# Altium schematic sheet DaughterBoard_Slots.SchDoc
size OrCAD B; SheetNumber: 3; SheetTotal: 6
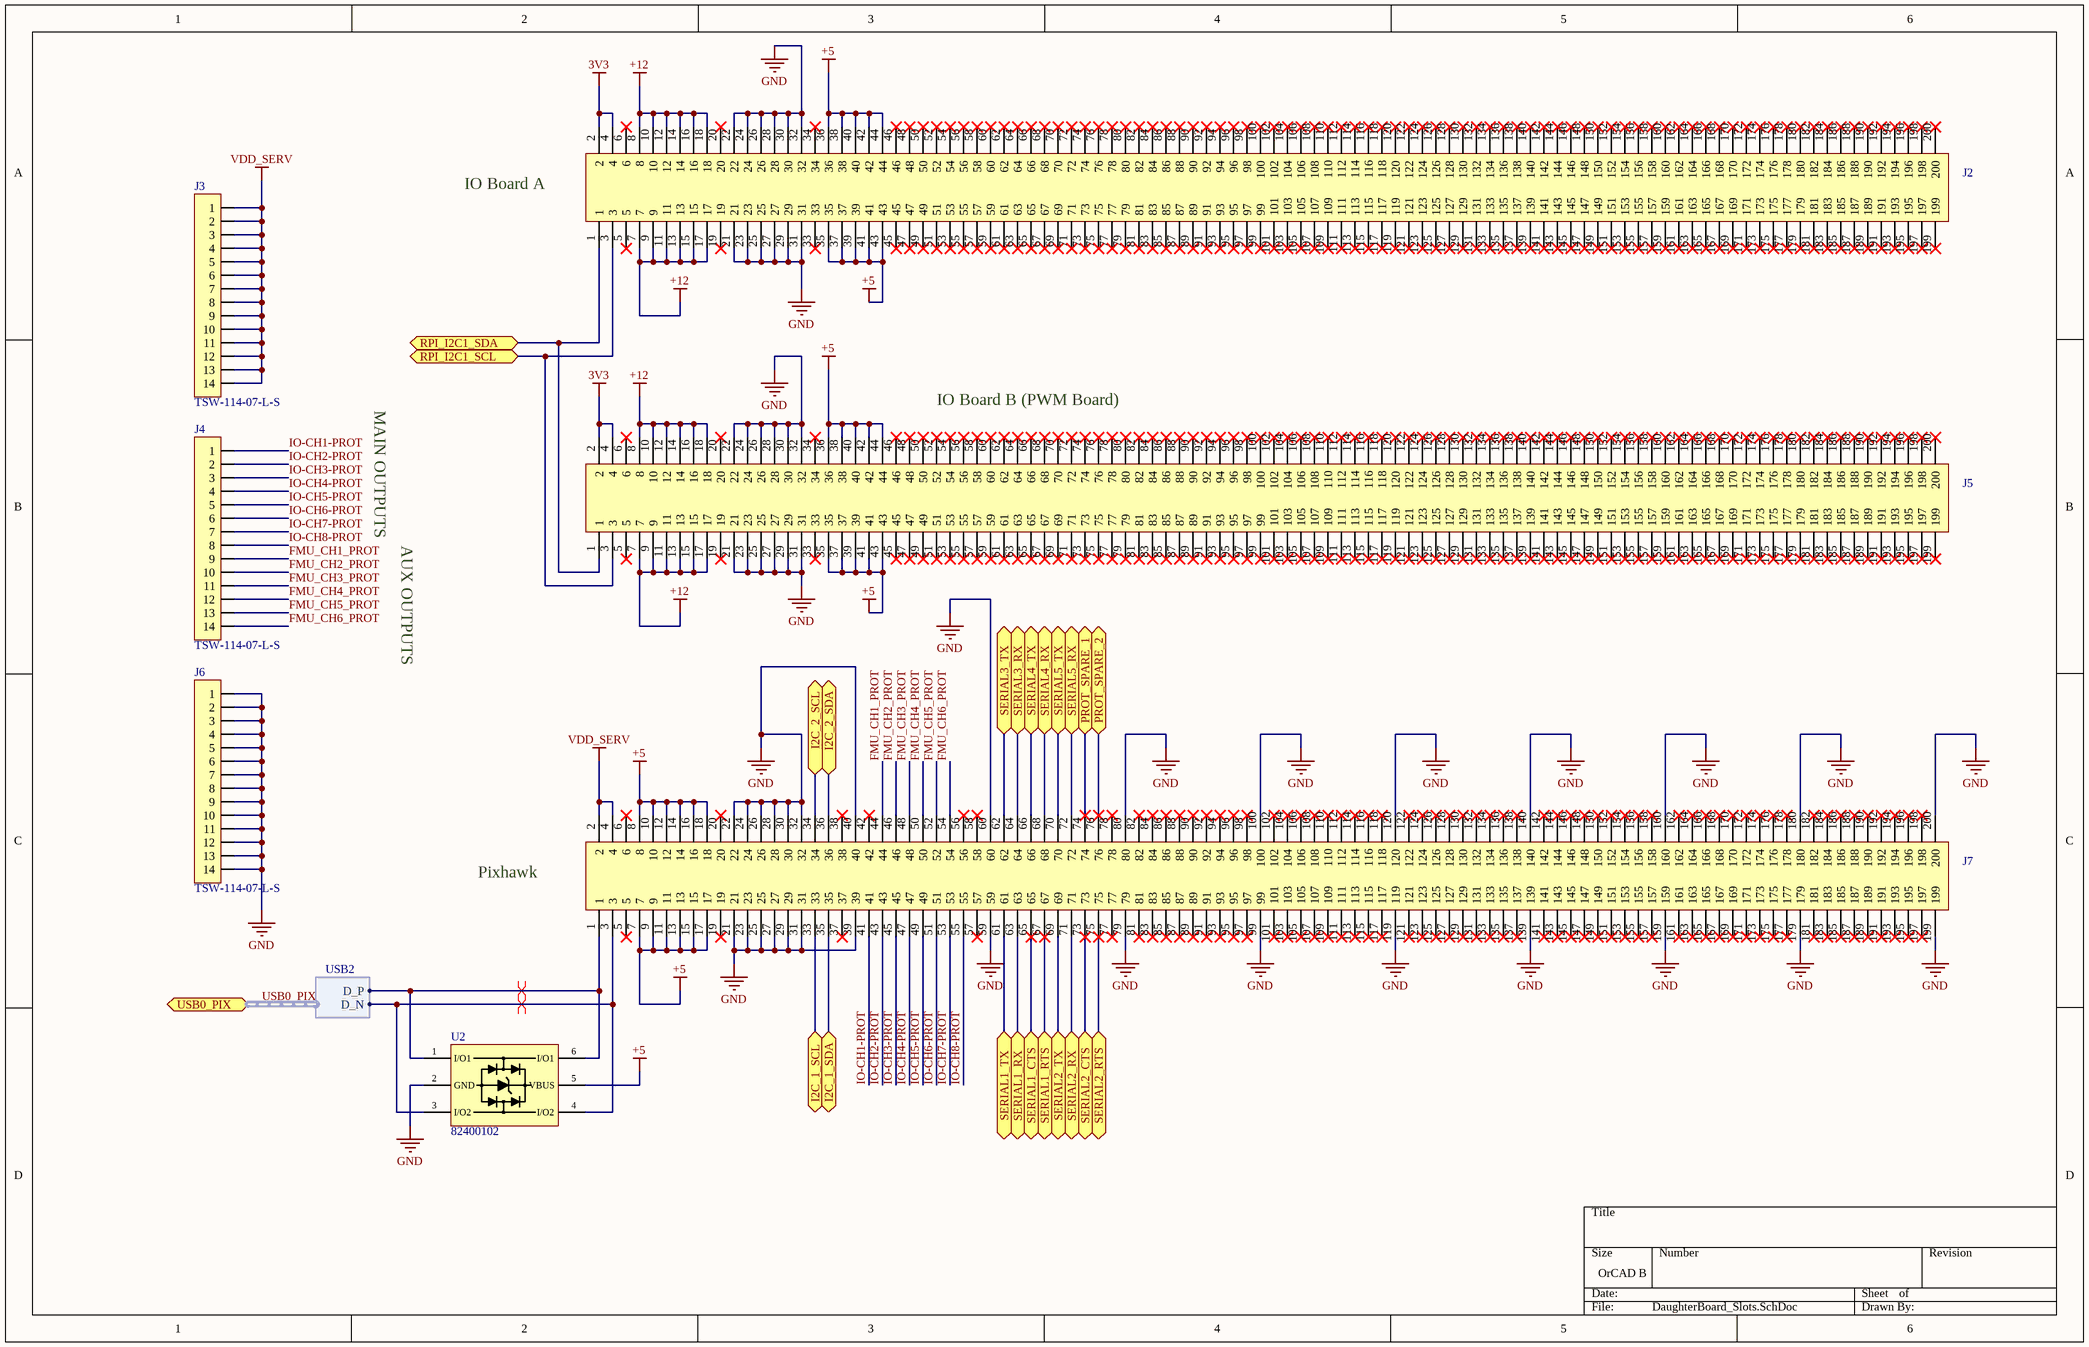
[diagram p0: DaughterBoard_Slots.SchDoc]

## Parts
J2  conn-100x2_0  [DDR1-SODIMM-V]  (value not drawn)
J3  TSW-114-07-L-S  [HDDR_14x1_0]
J4  TSW-114-07-L-S  [HDDR_14x1_0]
J5  conn-100x2_0  [DDR1-SODIMM-V]  (value not drawn)
J6  TSW-114-07-L-S  [HDDR_14x1_0]
J7  conn-100x2_0  [DDR1-SODIMM-V]  (value not drawn)
U2  82400102  [sot-23-6]

## Ports
I2C_1_SCL (bidir), I2C_1_SDA (bidir), I2C_2_SCL (bidir), I2C_2_SDA (bidir), PROT_SPARE_1 (bidir), PROT_SPARE_2 (bidir), RPI_I2C1_SCL (bidir), RPI_I2C1_SDA (bidir), SERIAL1_CTS (bidir), SERIAL1_RTS (bidir), SERIAL1_RX (bidir), SERIAL1_TX (bidir), SERIAL2_CTS (bidir), SERIAL2_RTS (bidir), SERIAL2_RX (bidir), SERIAL2_TX (bidir), SERIAL3_RX (bidir), SERIAL3_TX (bidir), SERIAL4_RX (bidir), SERIAL4_TX (bidir), SERIAL5_RX (bidir), SERIAL5_TX (bidir), USB0_PIX (bidir, harness USB2)

## Harnesses
USB2: D_P, D_N

## Nets
3V3: J2.2 J2.4 J5.2 J5.4
+5: J2.35 J2.36 J2.37 J2.38 J2.39 J2.40 J2.41 J2.42 J2.43 J2.44 J5.35 J5.36 J5.37 J5.38 J5.39 J5.40 J5.41 J5.42 J5.43 J5.44 J7.7 J7.8 J7.9 J7.10 J7.11 J7.12 J7.13 J7.14 J7.15 J7.16 J7.17 J7.18 U2.5(VBUS)
+12: J2.7 J2.8 J2.9 J2.10 J2.11 J2.12 J2.13 J2.14 J2.15 J2.16 J2.17 J2.18 J5.7 J5.8 J5.9 J5.10 J5.11 J5.12 J5.13 J5.14 J5.15 J5.16 J5.17 J5.18
GND: J2.21 J2.22 J2.23 J2.24 J2.25 J2.26 J2.27 J2.28 J2.29 J2.30 J2.31 J2.32 J5.21 J5.22 J5.23 J5.24 J5.25 J5.26 J5.27 J5.28 J5.29 J5.30 J5.31 J5.32 J6.1 J6.2 J6.3 J6.4 J6.5 J6.6 J6.7 J6.8 J6.9 J6.10 J6.11 J6.12 J6.13 J6.14 J7.21 J7.22 J7.23 J7.24 J7.25 J7.26 J7.27 J7.28 J7.29 J7.30 J7.31 J7.32 J7.39 J7.40 J7.59 J7.60 J7.79 J7.80 J7.99 J7.100 J7.119 J7.120 J7.139 J7.140 J7.159 J7.160 J7.179 J7.180 J7.199 J7.200 U2.2(GND)
VDD_SERV: J3.1 J3.2 J3.3 J3.4 J3.5 J3.6 J3.7 J3.8 J3.9 J3.10 J3.11 J3.12 J3.13 J3.14 J7.2 J7.4
FMU_CH1_PROT: J4.9 J7.44
FMU_CH2_PROT: J4.10 J7.46
FMU_CH3_PROT: J4.11 J7.48
FMU_CH4_PROT: J4.12 J7.50
FMU_CH5_PROT: J4.13 J7.52
FMU_CH6_PROT: J4.14 J7.54
I2C_1_SCL: J7.33 ; port I2C_1_SCL
I2C_1_SDA: J7.35 ; port I2C_1_SDA
I2C_2_SCL: J7.34 ; port I2C_2_SCL
I2C_2_SDA: J7.36 ; port I2C_2_SDA
IO-CH1-PROT: J4.1 J7.41
IO-CH2-PROT: J4.2 J7.43
IO-CH3-PROT: J4.3 J7.45
IO-CH4-PROT: J4.4 J7.47
IO-CH5-PROT: J4.5 J7.49
IO-CH6-PROT: J4.6 J7.51
IO-CH7-PROT: J4.7 J7.53
IO-CH8-PROT: J4.8 J7.55
PROT_SPARE_1: J7.74 ; port PROT_SPARE_1
PROT_SPARE_2: J7.76 ; port PROT_SPARE_2
RPI_I2C1_SCL: J2.3 J5.3 ; port RPI_I2C1_SCL
RPI_I2C1_SDA: J2.1 J5.1 ; port RPI_I2C1_SDA
SERIAL1_CTS: J7.65 ; port SERIAL1_CTS
SERIAL1_RTS: J7.67 ; port SERIAL1_RTS
SERIAL1_RX: J7.63 ; port SERIAL1_RX
SERIAL1_TX: J7.61 ; port SERIAL1_TX
SERIAL2_CTS: J7.73 ; port SERIAL2_CTS
SERIAL2_RTS: J7.75 ; port SERIAL2_RTS
SERIAL2_RX: J7.71 ; port SERIAL2_RX
SERIAL2_TX: J7.69 ; port SERIAL2_TX
SERIAL3_RX: J7.64 ; port SERIAL3_RX
SERIAL3_TX: J7.62 ; port SERIAL3_TX
SERIAL4_RX: J7.68 ; port SERIAL4_RX
SERIAL4_TX: J7.66 ; port SERIAL4_TX
SERIAL5_RX: J7.72 ; port SERIAL5_RX
SERIAL5_TX: J7.70 ; port SERIAL5_TX
USB0_PIX.D_N: J7.3 U2.3(I/O2) U2.4(I/O2) ; port USB0_PIX.D_N
USB0_PIX.D_P: J7.1 U2.1(I/O1) U2.6(I/O1) ; port USB0_PIX.D_P

Not connected (* = marked no-connect by the designer): J2 5* 6* 19* 20* 33* 34* 45* 46* 47* 48* 49* 50* 51* 52* 53* 54* 55* 56* 57* 58* 59* 60* 61* 62* 63* 64* 65* 66* 67* 68* 69* 70* 71* 72* 73* 74* 75* 76* 77* 78* 79* 80* 81* 82* 83* 84* 85* 86* 87* 88* 89* 90* 91* 92* 93* 94* 95* 96* 97* 98* 99* 100* 101* 102* 103* 104* 105* 106* 107* 108* 109* 110* 111* 112* 113* 114* 115* 116* 117* 118* 119* 120* 121* 122* 123* 124* 125* 126* 127* 128* 129* 130* 131* 132* 133* 134* 135* 136* 137* 138* 139* 140* 141* 142* 143* 144* 145* 146* 147* 148* 149* 150* 151* 152* 153* 154* 155* 156* 157* 158* 159* 160* 161* 162* 163* 164* 165* 166* 167* 168* 169* 170* 171* 172* 173* 174* 175* 176* 177* 178* 179* 180* 181* 182* 183* 184* 185* 186* 187* 188* 189* 190* 191* 192* 193* 194* 195* 196* 197* 198* 199* 200*; J5 5* 6* 19* 20* 33* 34* 45* 46* 47* 48* 49* 50* 51* 52* 53* 54* 55* 56* 57* 58* 59* 60* 61* 62* 63* 64* 65* 66* 67* 68* 69* 70* 71* 72* 73* 74* 75* 76* 77* 78* 79* 80* 81* 82* 83* 84* 85* 86* 87* 88* 89* 90* 91* 92* 93* 94* 95* 96* 97* 98* 99* 100* 101* 102* 103* 104* 105* 106* 107* 108* 109* 110* 111* 112* 113* 114* 115* 116* 117* 118* 119* 120* 121* 122* 123* 124* 125* 126* 127* 128* 129* 130* 131* 132* 133* 134* 135* 136* 137* 138* 139* 140* 141* 142* 143* 144* 145* 146* 147* 148* 149* 150* 151* 152* 153* 154* 155* 156* 157* 158* 159* 160* 161* 162* 163* 164* 165* 166* 167* 168* 169* 170* 171* 172* 173* 174* 175* 176* 177* 178* 179* 180* 181* 182* 183* 184* 185* 186* 187* 188* 189* 190* 191* 192* 193* 194* 195* 196* 197* 198* 199* 200*; J7 5* 6* 19* 20* 37* 38* 42* 56* 57* 58* 77* 78* 81* 82* 83* 84* 85* 86* 87* 88* 89* 90* 91* 92* 93* 94* 95* 96* 97* 98* 101* 102* 103* 104* 105* 106* 107* 108* 109* 110* 111* 112* 113* 114* 115* 116* 117* 118* 121* 122* 123* 124* 125* 126* 127* 128* 129* 130* 131* 132* 133* 134* 135* 136* 137* 138* 141* 142* 143* 144* 145* 146* 147* 148* 149* 150* 151* 152* 153* 154* 155* 156* 157* 158* 161* 162* 163* 164* 165* 166* 167* 168* 169* 170* 171* 172* 173* 174* 175* 176* 177* 178* 181* 182* 183* 184* 185* 186* 187* 188* 189* 190* 191* 192* 193* 194* 195* 196* 197* 198*

## Buses and harness runs
harness USB0_PIX = port USB0_PIX

## Layout directives
differential pair; differential pair class USB2-0: USB0_PIX.D_N, USB0_PIX.D_P

## Notes on the sheet
- (near J2) IO Board A
- MAIN OUTPUTS
- IO Board B (PWM Board)
- AUX OUTPUTS
- Pixhawk

## Library data of the parts
J2 J5 J7 = CONN-00056: Card-Edge Socket, DDR1 SODIMM (2.5V), 200-pin, Vertical; Manufacturer: TE Connectivity; Manufacturer PN: 2040910-1; Positions per level: 100; Levels: 2; Part Number: CONN-00056; Type: Card Socket; Cost: 5.43
J3 J4 J6 = CONN-00117: Header, 14x1, 0.1"; Manufacturer: Samtec; Positions per level: 14; Levels: 1; Part Number: CONN-00117; Type: Header; Manufacturer PN: TSW-114-07-L-S; Cost: 1.14; Distributor Link: https://www.digikey.com/en/products/detail/samtec-inc/TSW-114-07-L-S/1101413
U2 = DIO-00069: ESD Protec, 2-Ch, 2.5pF, 17V clamping voltage, SOT23-6; Manufacturer: ST; Manufacturer PN: USBLC6-2SC6Y; Forward Voltage: 1.1V; Reverse Breakdown Voltage: 6V; Current Rating: 5A; Part Number: DIO-00069; Type: TVS; Cost: 0.73